# Altium project PCB_Project.PrjPcb
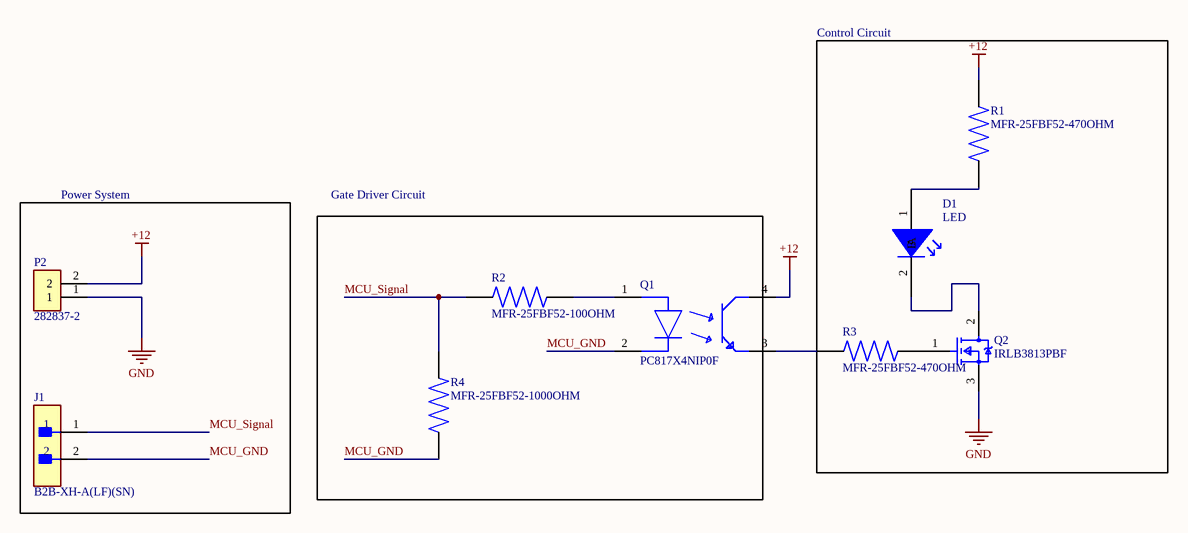
[diagram p0: Sheet1.SchDoc]
1 sheet, 9 parts. Net scope: global (net labels, ports and power ports of the same name join across sheets).
Board file: PCB1.PcbDoc

## Sheet Sheet1.SchDoc
size A; SheetNumber: 1; SheetTotal: 1

### Parts
D1  LED  [PCBComponent_1]
J1  B2B-XH-A(LF)(SN)  [FP-B2B-XH-A_LF_SN-MFG]
P2  282837-2  [TE_282837-2]
Q1  PC817X4NIP0F  [FP-PC817X4NIP0F-MFG]
Q2  IRLB3813PBF  [FP-PG-TO220-3-MFG]
R1  MFR-25FBF52-470OHM  [RESAD1100W55L680D260]
R2  MFR-25FBF52-100OHM  [RESAD1100W55L680D260]
R3  MFR-25FBF52-470OHM  [RESAD1100W55L680D260]
R4  MFR-25FBF52-1000OHM  [RESAD1100W55L680D260]

### Blocks framed on the sheet
Control Circuit: D1 Q2 R1 R3
Power System: J1 P2
Gate Driver Circuit: Q1 R2 R4

### Nets
+12: P2.2 Q1.4(C) R1.2
GND: P2.1 Q2.3(S)
MCU_GND: J1.2 Q1.2(C) R4.2
MCU_Signal: J1.1 R2.2 R4.1
NetD1_1: D1.1(A) R1.1
NetD1_2: D1.2(B) Q2.2(D)
NetQ1_1: Q1.1(A) R2.1
NetQ1_3: Q1.3(E) R3.2
NetQ2_1: Q2.1(G) R3.1

### Library data of the parts
D1 = LED: LED RED DIFFUSED T-1 3/4 T/H; Manufacturer: Kingbright; Manufacturer Product Number: WP7113ID; supplier: digikey; supplier part number: 754-1264-ND
J1 = CMP-2000-05888-3: CONN HEADER VERT 2POS 2.5MM; Current Rating: 3A; Voltage Rating: 250V; Number of Contacts: 2; Contact Resistance: 20mR; Wire/Cable Gauge: 22AWG; Insulation Resistance: 1GR; Connector Type: Male Pin; Packaging: Bulk; Contact Material: Brass; Lead Free: Lead Free; Orientation: Straight; Contact Plating: Tin; Max Current Rating: 3A; Termination: Solder; Fastening Type: Detent; Depth: 5.75mm; Housing Material: Polyamide; REACH SVHC: No SVHC; Series: XH; Voltage Rating (AC): 250V; Number of Positions: 2; Color: Natural; Contact Type: Male Pin; Max Voltage Rating (DC): 250V; Pitch: 2.5mm; Lead Pitch: 2.5mm; Mount: Through Hole; Max Operating Temperature: 85°C; Length: 7.4mm; Max Voltage Rating (AC): 250V; Min Operating Temperature: -25°C; Number of Rows: 1; Housing Color: White
P2 = 282837-2: Ð Ð°Ð·ÑŠÐµÐ¼Ð½Ñ‹Ðµ ÐºÐ»ÐµÐ¼Ð¼Ð½Ñ‹Ðµ ÐºÐ¾Ð»Ð¾Ð´ÐºÐ¸ Ð Ð¾Ð·ÐµÑ‚ÐºÐ° 2 Ð¿Ð¾Ð»Ð¾Ð¶ÐµÐ½Ð¸Ñ 5,08 Ð¼Ð¼ ÐŸÑ€Ð¸Ð¿Ð¾Ð¹ Ð¿Ñ€ÑÐ¼Ð¾Ð¹ Ñ‡ÐµÑ€ÐµÐ· Ð¾Ñ‚Ð²ÐµÑ€ÑÑ‚Ð¸Ðµ 13,5 Ð / ÐºÐ¾Ð½Ñ‚Ð°ÐºÑ‚; MF: TE Connectivity; SnapEDA_Link: https://www.snapeda.com/parts/282837-2/TE+Connectivity+AMP+Connectors/view-part/?ref=snap; Price: None; Check_prices: https://www.snapeda.com/parts/282837-2/TE+Connectivity+AMP+Connectors/view-part/?ref=eda; Purchase-URL: https://pricing.snapeda.com/search/part/282837-2/?ref=eda; MP: 282837-2; Value: *; Availability: In Stock; Package: None
Q1 = CMP-65434-000001-1: OPTOISOLATOR 5KV TRANS 4SMD; Manufacturer: Sharp; Collector Emitter Voltage: 80V; Standoff Height: 0.1mm; Power Dissipation: 200mW; Min Current Transfer Ratio: 50%; Description: Optocoupler DC-IN 1-CH Transistor DC-OUT 4-Pin PDIP SMD; Reverse Voltage: 6V; Forward Current: 20mA; Forward Voltage: 1.2V; Max Current Transfer Ratio: 600%; Isolation Voltage: 5kVrms; Mouser Description: Transistor Output Optocouplers Photocoupler 300-600% CRT; RoHS: TRUE; ComponentLink2URL: https://www.sharpsde.com/fileadmin/products/Optoelectronics/Isolation%20Devices/Specs%20Photocoupler/PC817XxNIP0F_17Jun08_Spec_ED-04P129A.pdf; Lead Free: Yes; Device Class L1: Optoelectronics; ComponentLink2Description: Datasheet; Device Class L2: Optocouplers; Temperature: -30°C to +100°C; Temperature Range Low: -30°C; Automotive: No; Temperature Range High: +100°C; Octopart: https://octopart.com/pc817x4nip0f-sharp-20650453; Height: 4.6mm; Digikey Description: OPTOISOLATOR 5KV TRANS 4SMD; Category: Trans; Device Class L3: unset; Package: PC817X4NIP0F; Manufacturer Part Number: PC817X4NIP0F; Emiiter Collector Voltage: 6V
Q2 = CMP-32901-000118-1: MOSFET N-CH 30V 260A TO-220AB; Manufacturer: Infineon; Threshold Vgs Max: 2.35V; Gate To Source Voltage: 20V; Number Of N Channels: 1; Threshold Vgs Min: 1.35V; Gate Charge At Vgs: 57nC @ 4.5V; Depletion Mode: False; Max Junction Temp: +175°C; Standoff Height: 3.37mm; Input Capacitace At Vds: 8420pF @ 15V; Reverse Recovery Charge: 22nC; Drain To Source Resistance: 2mΩ; Reverse Recovery Time: 24ns; Pulse Drain Current: 1050A; Turn Off Delay Time: 33ns; Turn On Delay Time: 36ns; Rthja Max: 62°C/W; Max Forward Diode Voltage: 1V; Power Dissipation: 230W; Digikey Description: MOSFET N-CH 30V 260A TO-220AB; Device Class L2: Transistors; Device Class L3: MOSFETs; Device Class L1: Discrete Semiconductors; Footprint Url: https://www.infineon.com/dgdl/po-to220ab-fp.pdf?fileId=5546d462580663ef0158068cfbee01be; ComponentLink2Description: Datasheet; Continuous Drain Current: 260A; Drain To Source Voltage: 30V; Temperature: -55°C to +175°C; Temperature Range Low: -55°C; Octopart: https://octopart.com/irlb3813pbf-infineon-65874923; Number Of Channels: 1; Drain To Source Breakdown Voltage: 30V; Height: 19.8mm; Temperature Range High: +175°C; RoHS: TRUE; Automotive: No; Category: Trans; ComponentLink2URL: https://www.infineon.com/dgdl/irlb3813pbf.pdf?fileId=5546d462533600a4015356603cfe258b; Manufacturer Part Number: IRLB3813PBF; Package: PG-TO220-3; Lead Free: Yes
R1-R4 = MFR-25FBF52-1K: 1.07 kOhms Â±1% 0.25W, 1/4W Through Hole Resistor Axial - Metal Film; MF: Yageo; Value: *; SnapEDA_Link: https://www.snapeda.com/parts/MFR-25FBF52-1K/Yageo/view-part/?ref=snap; Purchase-URL: https://pricing.snapeda.com/search/part/MFR-25FBF52-1K/?ref=eda; Availability: In Stock; Price: None; Package: Axial Yageo; Check_prices: https://www.snapeda.com/parts/MFR-25FBF52-1K/Yageo/view-part/?ref=eda; MP: MFR-25FBF52-1K